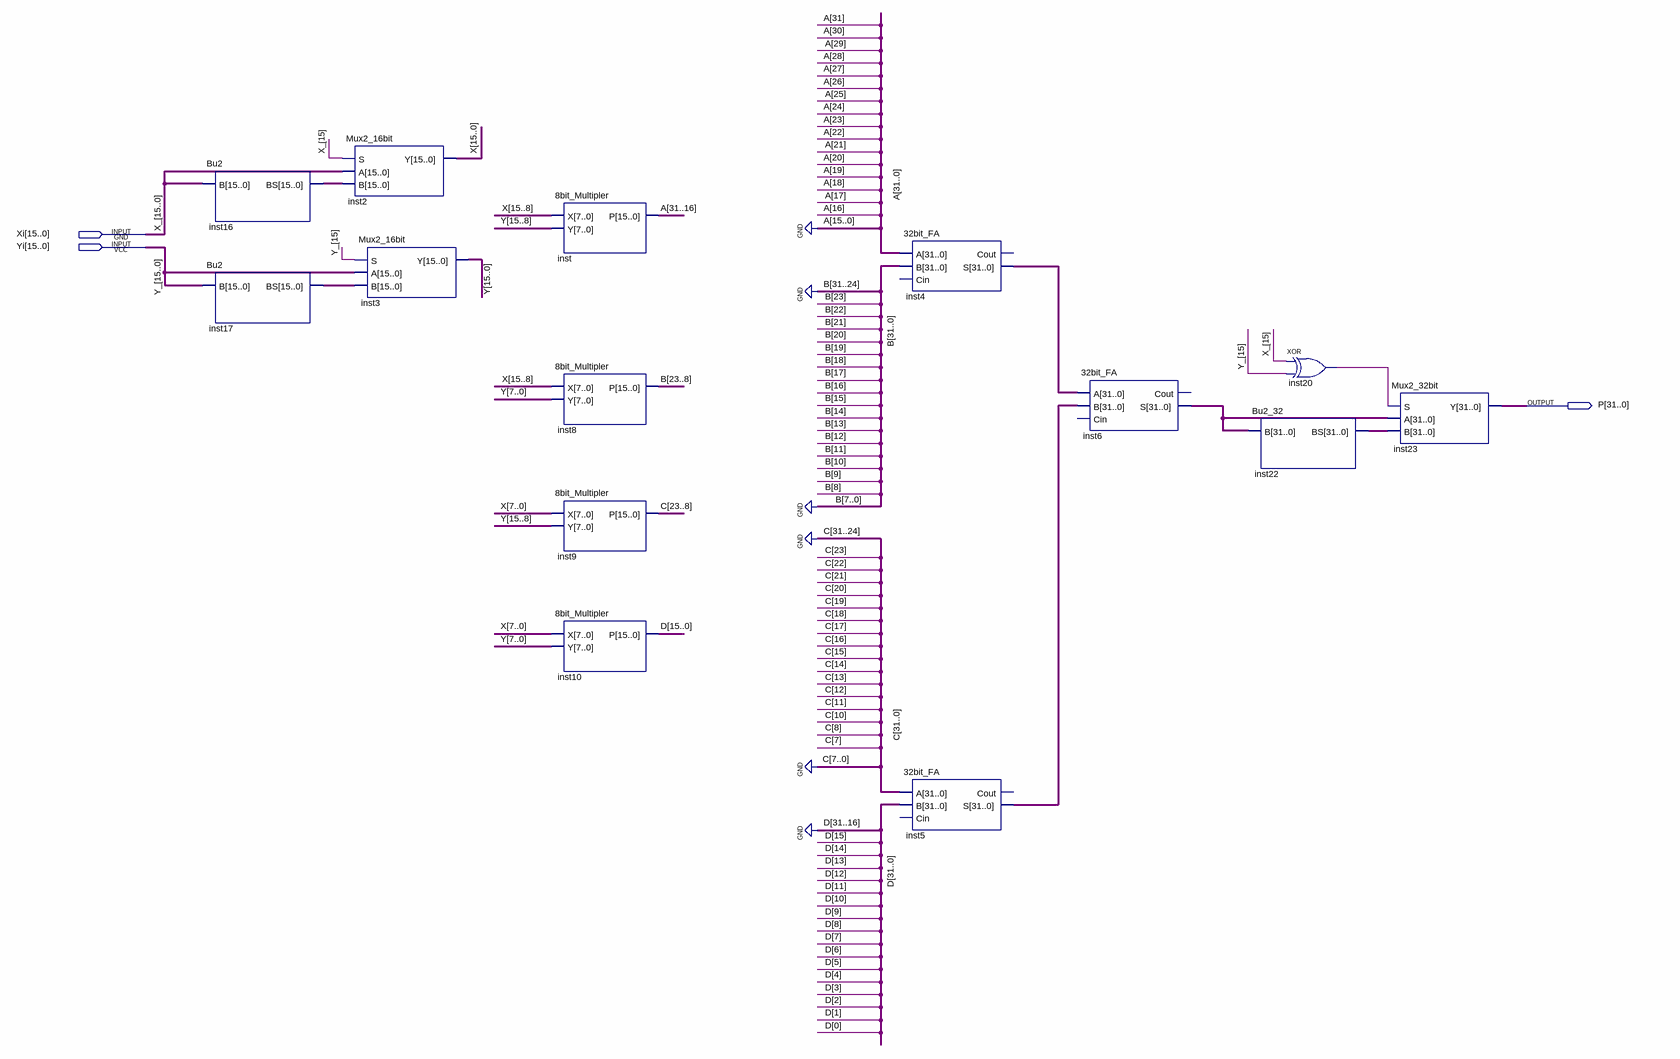
[diagram p0: schematic sheet]
// Quartus schematic 16bit_Multipler.bdf as structural Verilog: 14 symbols, 3 pins
module \16bit_Multipler  (
  input  [15:0] Xi,
  input  [15:0] Yi,
  output [31:0] P
);

  wire inst20_out;
  wire [15:0] D, inst16_bs, inst17_bs, X, Y;
  wire [23:8] B, C;
  wire [31:0] inst4_s, inst5_s, inst6_s, inst22_bs;
  wire [31:16] A;

  Bu2 inst16 (.B(Xi), .BS(inst16_bs));
  Bu2 inst17 (.B(Yi), .BS(inst17_bs));
  Mux2_16bit inst2 (.S(Xi[15]), .A(Xi), .B(inst16_bs), .Y(X));
  Mux2_16bit inst3 (.S(Yi[15]), .A(Yi), .B(inst17_bs), .Y(Y));
  \8bit_Multipler  inst (.X(X[15:8]), .Y(Y[15:8]), .P(A));
  \8bit_Multipler  inst8 (.X(X[15:8]), .Y(Y[7:0]), .P(B));
  \8bit_Multipler  inst9 (.X(X[7:0]), .Y(Y[15:8]), .P(C));
  \8bit_Multipler  inst10 (.X(X[7:0]), .Y(Y[7:0]), .P(D));
  \32bit_FA  inst4 (.A({A, {16{1'b0}}}), .B({{8{1'b0}}, B, {8{1'b0}}}), .S(inst4_s));  // open: Cin, Cout
  \32bit_FA  inst5 (.A({{8{1'b0}}, C, {8{1'b0}}}), .B({{16{1'b0}}, D}), .S(inst5_s));  // open: Cin, Cout
  \32bit_FA  inst6 (.A(inst4_s), .B(inst5_s), .S(inst6_s));  // open: Cin, Cout
  Bu2_32 inst22 (.B(inst6_s), .BS(inst22_bs));
  xor inst20 (inst20_out, Xi[15], Yi[15]);
  Mux2_32bit inst23 (.S(inst20_out), .A(inst6_s), .B(inst22_bs), .Y(P));

  // Other names for the same wires on the sheet: X_[15:0] = Xi; Y_[15:0] = Yi
endmodule
